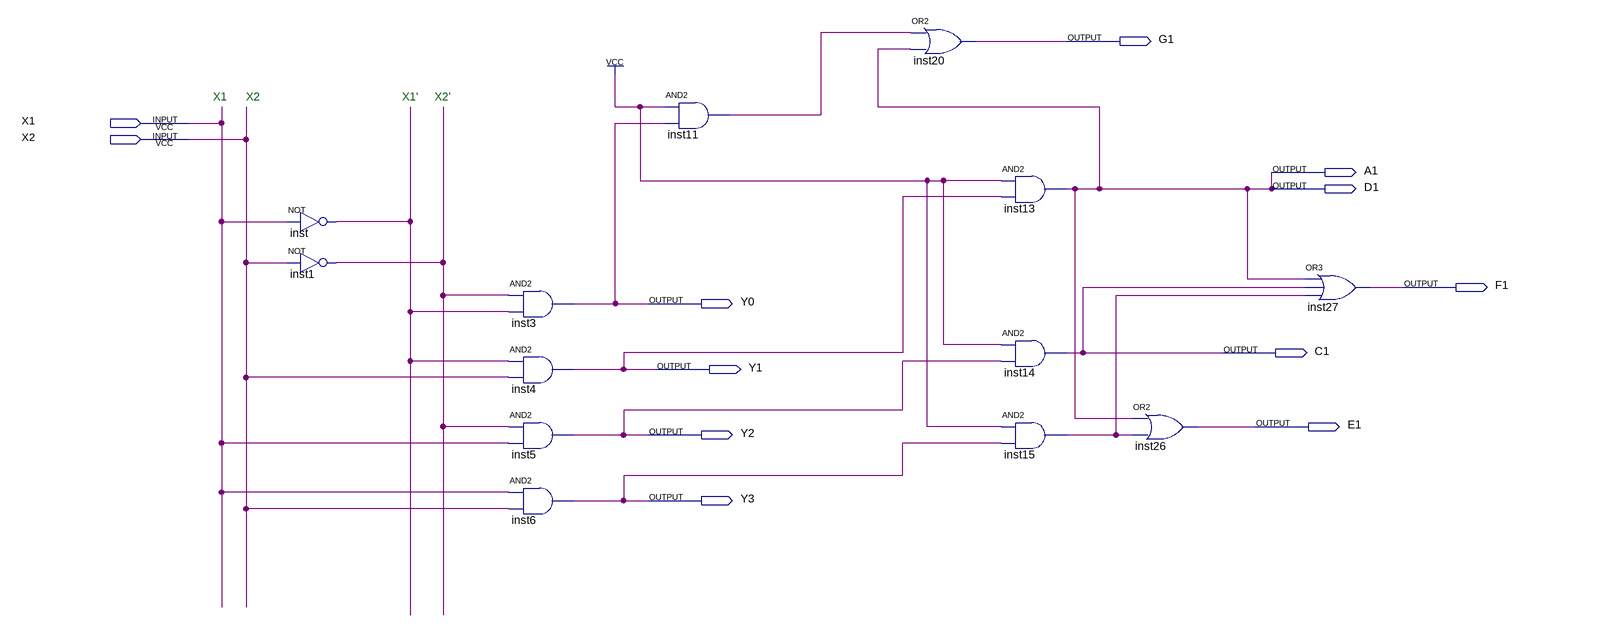
[diagram p0: schematic sheet]
// Quartus schematic Cmb1.bdf as structural Verilog: 13 symbols, 12 pins
module Cmb1 (
  input  X1,
  input  X2,
  output G1,
  output A1,
  output D1,
  output F1,
  output Y0,
  output C1,
  output Y1,
  output E1,
  output Y2,
  output Y3
);

  wire inst1_out, inst11_out, inst15_out, inst_out;

  not inst (inst_out, X1);
  not inst1 (inst1_out, X2);
  and inst3 (Y0, inst1_out, inst_out);
  and inst4 (Y1, inst_out, X2);
  and inst5 (Y2, inst1_out, X1);
  and inst6 (Y3, X1, X2);
  and inst11 (inst11_out, 1'b1, Y0);
  or inst20 (G1, inst11_out, A1);
  and inst13 (A1, 1'b1, Y1);
  and inst14 (C1, 1'b1, Y2);
  and inst15 (inst15_out, 1'b1, Y3);
  or inst26 (E1, A1, inst15_out);
  or inst27 (F1, A1, C1, inst15_out);

  assign D1 = A1;

  // Notes on the sheet:
  //   X1
  //   X2
  //   X1'
  //   X2'
endmodule
